# Altium schematic sheet ASBB_VarBuck.SchDoc
size A4
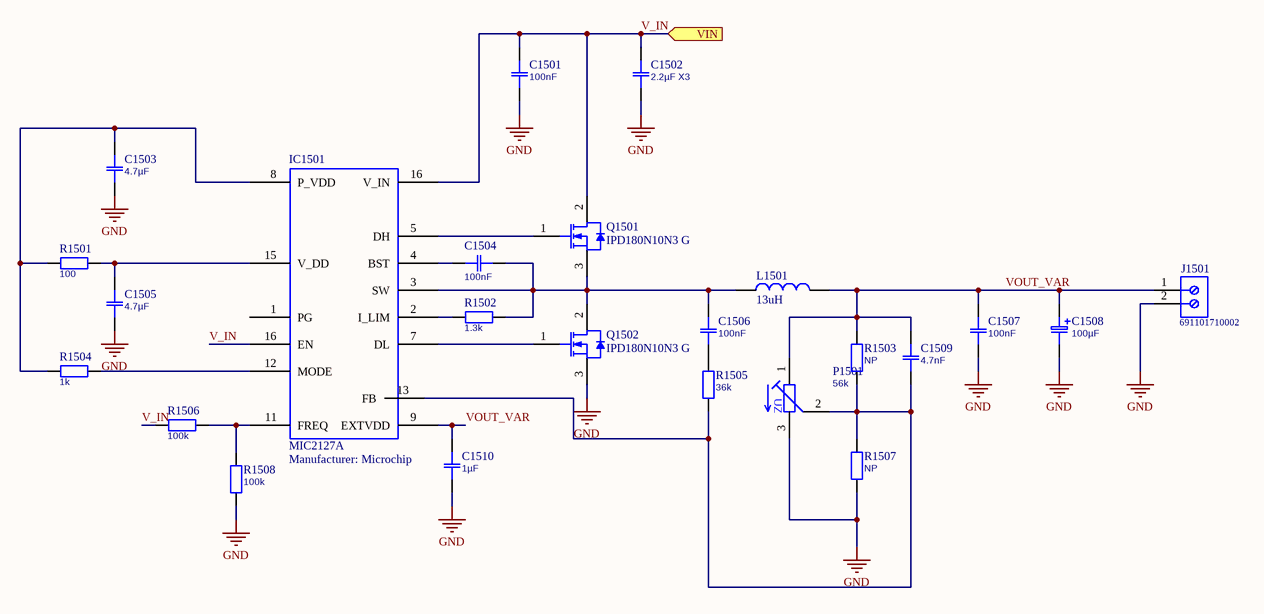
[diagram p0: ASBB_VarBuck.SchDoc]

## Parts
C1501  100nF  [CAP 1206/3216]
C1502  2.2µF X3  [CAP 1206/3216]
C1503  4.7µF  [CAP 1206/3216]
C1504  100nF  [CAP 1206/3216]
C1505  4.7µF  [CAP 1206/3216]
C1506  100nF  [0603]
C1507  100nF  [0603]
C1508  100µF  [CAP ALUM 6.6MM]
C1509  4.7nF  [0603]
C1510  1µF  [0603]
IC1501  MIC2127A  Manufacturer: Microchip  [MCHP-QFN-MG16_N]
J1501  691101710002  [691101710002]
L1501  value 13uH  [WE-HCI_1365_WE-PERM]  (hidden comment: 7443551131)
P1501  56k  [Model 43 Trimmer]
Q1501  IPD180N10N3 G  [INF-PG-TO252-3-11_A_N]
Q1502  IPD180N10N3 G  [INF-PG-TO252-3-11_A_N]
R1501  100  [0603]
R1502  1.3k  [0603]
R1503  NP  [0603]
R1504  1k  [0603]
R1505  36k  [0603]
R1506  100k  [CAP 1206/3216]
R1507  NP  [0603]
R1508  100k  [CAP 1206/3216]

## Ports
VIN (in)

## Nets
GND: C1501.1 C1502.1 C1503.2 C1505.2 C1507.2 C1508.2(-) C1510.2 J1501.2 P1501.3 Q1502.3(SOURCE) R1507.1 R1508.1
V_IN: C1501.2 C1502.2 IC1501.16(EN) Q1501.2(DRAIN) R1506.1 ; port VIN
VOUT_VAR: C1507.1 C1508.1(+) C1509.1 C1510.1 IC1501.9(EXTVDD) J1501.1 L1501.2 P1501.1 R1503.2
NetC1503_1: C1503.1 IC1501.8(P_VDD) R1501.1 R1504.1
NetC1504_1: C1504.1 C1506.1 IC1501.3(SW) L1501.1 Q1501.3(SOURCE) Q1502.2(DRAIN) R1502.2
NetC1504_2: C1504.2 IC1501.4(BST)
NetC1505_1: C1505.1 IC1501.15(V_DD) R1501.2
NetC1506_2: C1506.2 R1505.2
NetC1509_2: C1509.2 IC1501.13(FB) P1501.2 R1503.1 R1505.1 R1507.2
NetIC1501_2: IC1501.2(I_LIM) R1502.1
NetIC1501_5: IC1501.5(DH) Q1501.1(GATE)
NetIC1501_7: IC1501.7(DL) Q1502.1(GATE)
NetIC1501_11: IC1501.11(FREQ) R1506.2 R1508.2
NetIC1501_12: IC1501.12(MODE) R1504.2

Not connected (* = marked no-connect by the designer): IC1501 1(PG)

## Notes on the sheet
- (in symbol Potentiometer) UZ

## Library data of the parts
C1501-C1507 C1509 C1510 = Capacitor: Partnumber: ?; Value: ?
C1508 = Capacitor polarised: Capacitor, polarised; Partnumber: ?; Value: ?
IC1501 = MIC2127A: 75V, Synchronous Buck Controller Featuring ADaptive On-Time Control
J1501 = 691101710002: Series 101 - 5.00 mm Horizontal Entry Modular with Pressure Clamp WR-TBL, 2 pin; Pin Number: 2; Pitch: 5.00 mm; ComponentLink1Description: Manufacturer; ComponentLink1URL: http://www.we-online.de; ComponentLink2Description: Datasheet; ComponentLink2URL: http://katalog.we-online.de/em/datasheet/6911017100xx.pdf; Part Number: 691101710002; Published Date: May 2018; Publisher: Wurth Elektronik; Operating Temperature: -40 to 105 degC; Mounting Technology: THT; Packaging: Box
L1501 = 7443551131: WE-HCI SMD Flat Wire High Current Inductor, size 1365, 10A, 13uH; Material: WE-PERM; ComponentLink1Description: Manufacturer; ComponentLink1URL: http://www.we-online.de; ComponentLink2Description: Datasheet; ComponentLink2URL: http://katalog.we-online.de/pbs/datasheet/7443551131.pdf; Part Number: 7443551131; Published Date: July 2017; Publisher: Wurth Elektronik; Rated Current: 10A; Size: 1365
P1501 = Potentiometer: Partnumber: ?; Value: ?
Q1501 Q1502 = IPD180N10N3 G: N-Channel OptiMOS 3 Power-Transistor, 100 V VDS, 43 A ID, -55 to 175 degC, PG-TO252-3-11, Reel, Green; Manufacturer: Infineon; Green: TRUE; ID (max): 43 A; IDpuls (max): 172 A; Polarity: N; Ptot (max): 71 W; QG: 19 nC; RDS (on) (max): 18 mOhm; Rth: 2.1 K/W; RthJA (max): 75 K/W; VDS (max): 100 V; VGS(th) (max): 3.5 V; VGS(th) (min): 2 V; DatasheetVersion: Rev. 2.2; PackageVersion: Rev. 02, 03/2007; PackageReference: PG-TO252-3-11; PackageDescription: 3-Pin Plastic (Green) Transistor Single Outline Package, 6.57 x 6.1 mm Body, 2.29 mm Pitch; Supplier 1: Digi-Key; Supplier Part Number 1: IPD180N10N3 GTR-ND; Supplier 2: Digi-Key; Supplier Part Number 2: IPD180N10N3 GCT-ND; Supplier 3: Digi-Key; Supplier Part Number 3: IPD180N10N3 GDKR-ND; Packing: Reel; RthJC (max): 2.1 K/W; Mounting Technology: Surface Mount; PartNumber: IPD180N10N3 G; ComponentLink1Description: Manufacturer URL; ComponentLink1URL: http://www.infineon.com/; ComponentLink2Description: Datasheet; ComponentLink2URL: http://www.infineon.com/dgdl/IPD180N10N3+G_Rev2.2.pdf?folderId=db3a304313b8b5a60113cee8763b02d7&fileId=db3a30432239cccd01226070a4bb7fb9; ComponentLink3Description: Package Specification; ComponentLink3URL: http://www.infineon.com/dgdl/IPD160N04L_rev1.0.pdf?folderId=db3a3043163797a6011643468e7505a4&fileId=db3a3043163797a60116436401cf05cf
R1501-R1508 = Resistor: Partnumber: ?; Value: ?